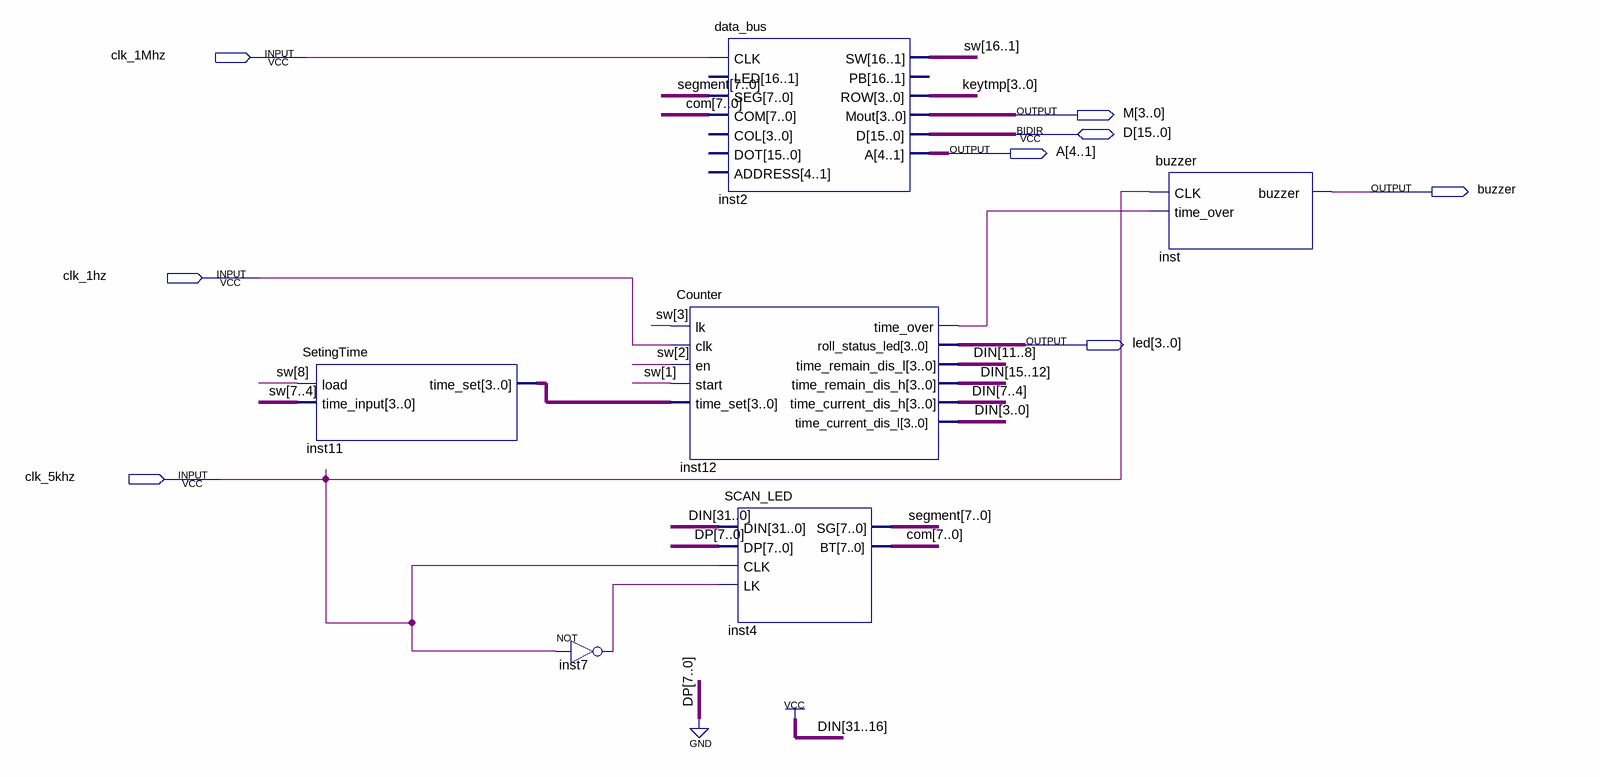
[diagram p0: schematic sheet]
// Quartus schematic top.bdf as structural Verilog: 6 symbols, 8 pins
module top (
  input  clk_1Mhz,
  input  clk_1hz,
  input  clk_5khz,
  inout  [15:0] D,
  output [3:0] M,
  output [4:1] A,
  output buzzer,
  output [3:0] led
);

  wire inst7_out, inst12_time_over;
  wire [3:0] inst11_time_set, keytmp;
  wire [7:0] com, segment;
  wire [15:0] DIN;
  wire [16:1] sw;

  SetingTime inst11 (.load(sw[8]), .time_input(sw[7:4]), .time_set(inst11_time_set));
  not inst7 (inst7_out, clk_5khz);
  Counter inst12 (
    .lk(sw[3]), .clk(clk_1hz), .en(sw[2]), .start(sw[1]), .time_set(inst11_time_set),
    .time_over(inst12_time_over), .roll_status_led(led), .time_remain_dis_l(DIN[11:8]),
    .time_remain_dis_h(DIN[15:12]), .time_current_dis_h(DIN[7:4]), .time_current_dis_l(DIN[3:0]));
  data_bus inst2 (
    .CLK(clk_1Mhz), .SEG(segment), .COM(com), .SW(sw), .ROW(keytmp), .Mout(M), .A(A), .D(D));  // open: LED, COL, DOT, ADDRESS, PB
  SCAN_LED inst4 (.DIN({{16{1'b1}}, DIN}), .DP({8{1'b0}}), .CLK(clk_5khz), .LK(inst7_out), .SG(segment), .BT(com));
  buzzer inst (.CLK(clk_5khz), .time_over(inst12_time_over), .buzzer(buzzer));
endmodule
